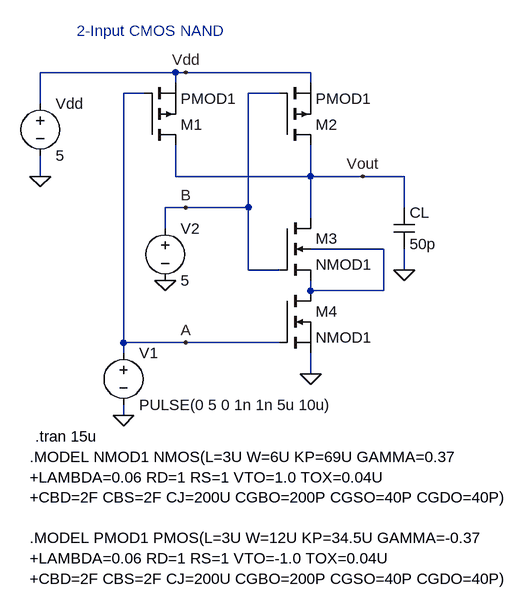
[diagram p0: schematic cmos_2input.asc]
cmos_2input.asc, the LTspice schematic file:
Version 4
SHEET 1 972 680
WIRE 432 -144 224 -144
WIRE 448 -144 432 -144
WIRE 640 -144 448 -144
WIRE 432 -128 432 -144
WIRE 640 -128 640 -144
WIRE 384 -112 352 -112
WIRE 592 -112 544 -112
WIRE 224 -96 224 -144
WIRE 224 16 224 -16
WIRE 432 16 432 -32
WIRE 640 16 640 -32
WIRE 640 16 432 16
WIRE 720 16 640 16
WIRE 784 16 720 16
WIRE 448 64 416 64
WIRE 544 64 544 -112
WIRE 544 64 448 64
WIRE 784 64 784 16
WIRE 640 80 640 16
WIRE 416 96 416 64
WIRE 752 128 640 128
WIRE 544 160 544 64
WIRE 592 160 544 160
WIRE 784 160 784 128
WIRE 640 192 640 176
WIRE 752 192 752 128
WIRE 752 192 640 192
WIRE 352 272 352 -112
WIRE 448 272 352 272
WIRE 592 272 448 272
WIRE 352 288 352 272
WIRE 640 320 640 288
WIRE 352 384 352 368
FLAG 352 384 0
FLAG 416 176 0
FLAG 224 16 0
FLAG 448 -144 Vdd
FLAG 640 320 0
FLAG 720 16 Vout
FLAG 448 64 B
FLAG 448 272 A
FLAG 784 160 0
SYMBOL voltage 352 272 R0
WINDOW 123 0 0 Left 0
WINDOW 39 0 0 Left 0
SYMATTR InstName V1
SYMATTR Value PULSE(0 5 0 1n 1n 5u 10u)
SYMBOL voltage 416 80 R0
SYMATTR InstName V2
SYMATTR Value 5
SYMBOL pmos 384 -32 M180
SYMATTR InstName M1
SYMATTR Value PMOD1
SYMBOL pmos 592 -32 M180
SYMATTR InstName M2
SYMATTR Value PMOD1
SYMBOL nmos 592 192 R0
SYMATTR InstName M4
SYMATTR Value NMOD1
SYMBOL voltage 224 -112 R0
SYMATTR InstName Vdd
SYMATTR Value 5
SYMBOL cap 768 64 R0
SYMATTR InstName CL
SYMATTR Value 50p
SYMBOL nmos4 592 80 R0
SYMATTR InstName M3
SYMATTR Value NMOD1
TEXT 280 -208 Left 2 ;2-Input CMOS NAND
TEXT 208 448 Left 2 !.MODEL NMOD1 NMOS(L=3U W=6U KP=69U GAMMA=0.37\n+LAMBDA=0.06 RD=1 RS=1 VTO=1.0 TOX=0.04U\n+CBD=2F CBS=2F CJ=200U CGBO=200P CGSO=40P CGDO=40P)\n \n.MODEL PMOD1 PMOS(L=3U W=12U KP=34.5U GAMMA=-0.37\n+LAMBDA=0.06 RD=1 RS=1 VTO=-1.0 TOX=0.04U\n+CBD=2F CBS=2F CJ=200U CGBO=200P CGSO=40P CGDO=40P)
TEXT 216 416 Left 2 !.tran 15u

The netlist it stands for:
* cmos_2input.asc
V1 A 0 PULSE(0 5 0 1n 1n 5u 10u)
V2 B 0 5
M1 Vout A Vdd Vdd PMOD1
M2 Vout B Vdd Vdd PMOD1
M4 N001 A 0 0 NMOD1
Vdd Vdd 0 5
CL Vout 0 50p
M3 Vout B N001 N001 NMOD1
.model NMOS NMOS
.model PMOS PMOS
.lib standard.mos
* 2-Input CMOS NAND
.MODEL NMOD1 NMOS(L=3U W=6U KP=69U GAMMA=0.37
+LAMBDA=0.06 RD=1 RS=1 VTO=1.0 TOX=0.04U
+CBD=2F CBS=2F CJ=200U CGBO=200P CGSO=40P CGDO=40P)
.MODEL PMOD1 PMOS(L=3U W=12U KP=34.5U GAMMA=-0.37
+LAMBDA=0.06 RD=1 RS=1 VTO=-1.0 TOX=0.04U
+CBD=2F CBS=2F CJ=200U CGBO=200P CGSO=40P CGDO=40P)
.tran 15u
.backanno
.end

* Results of the author's LTspice run, read from the files saved beside the schematic
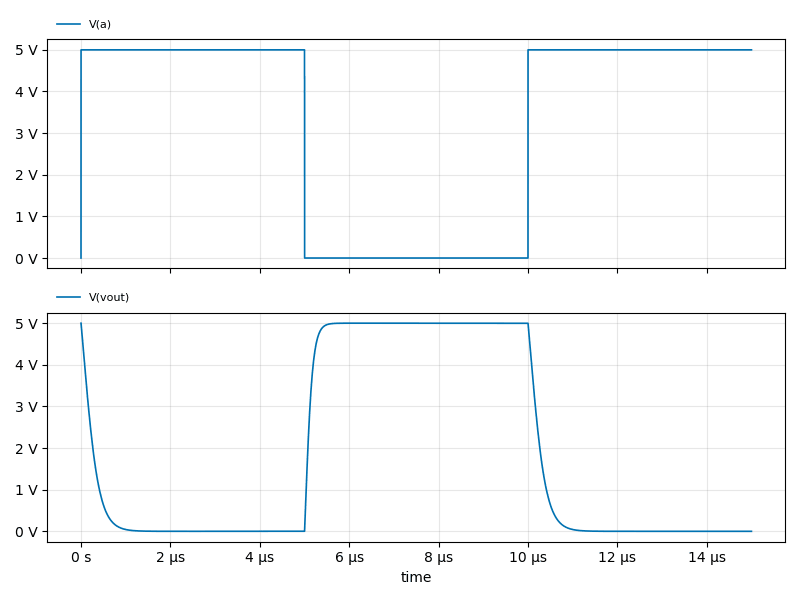
[diagram p1: Transient Analysis of cmos_2input.asc, plotted from the saved traces]
* Transient Analysis, 1 run:
*   V(a): min 0 V, max 5 V, average 3.334 V, rms 4.082 V, last 5 V
*   V(vout): min -118.3 µV, max 5.001 V, average 1.8 V, rms 2.922 V, last 0 V